# Altium schematic sheet Power.SchDoc (part 1 of 3)
size A3; SheetNumber: 2; SheetTotal: 5
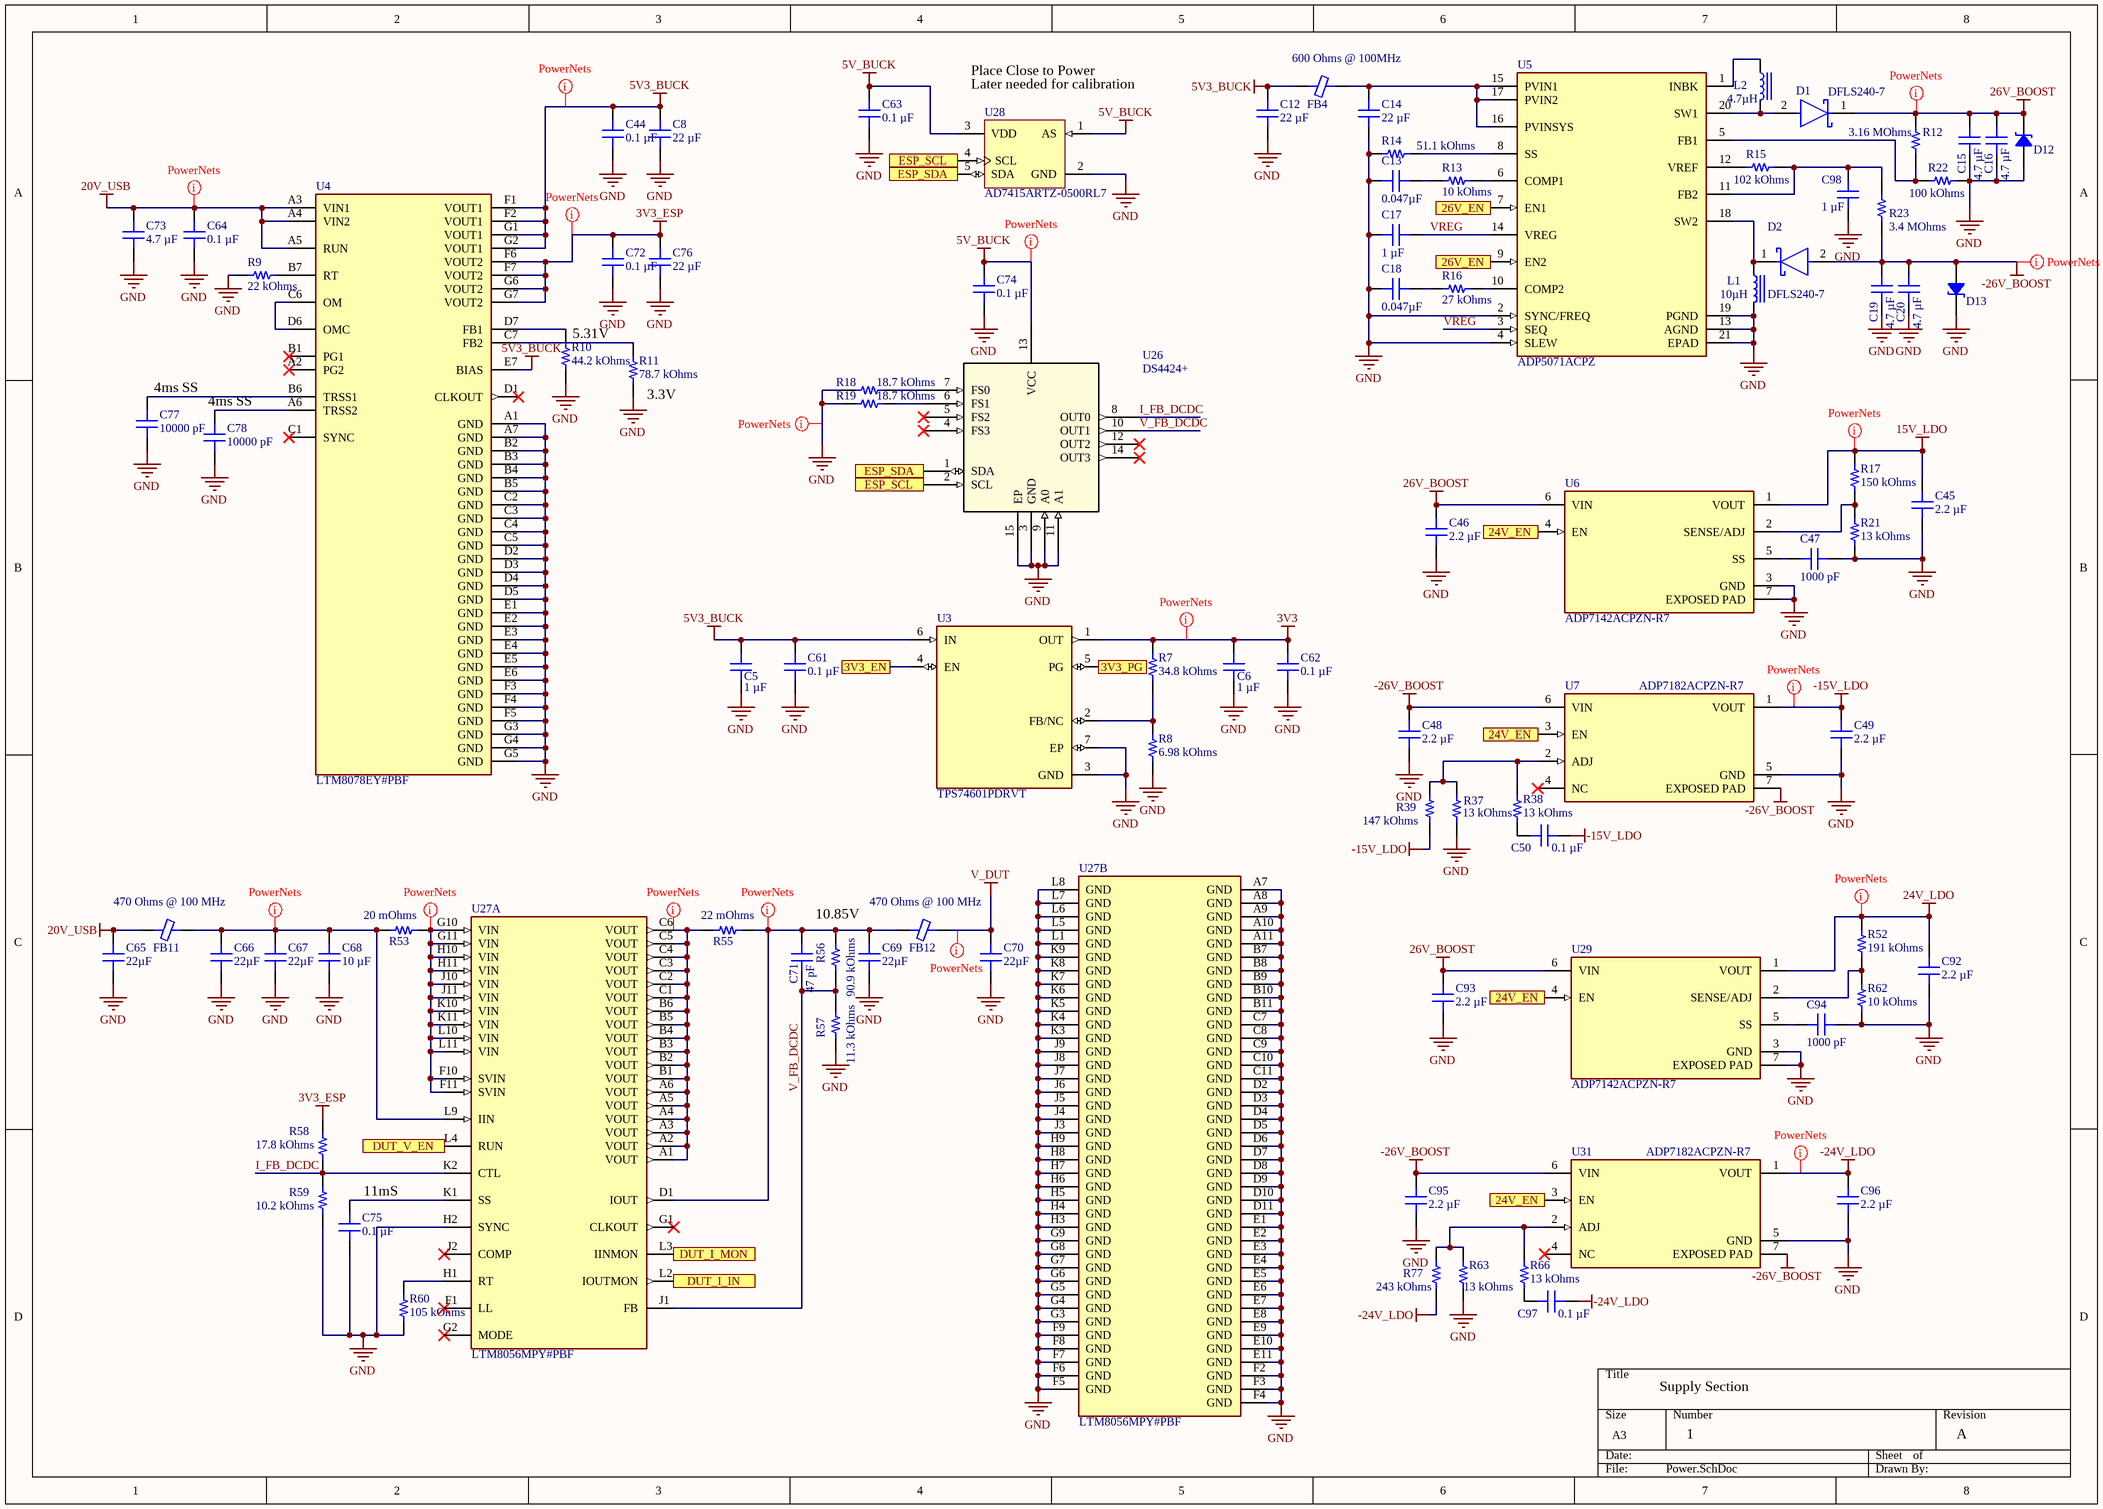
[diagram p0: Power.SchDoc]

## Parts
C5  1 µF  [CAP 0603_1608]
C6  1 µF  [CAP 0603_1608]
C8  22 µF  [CAP 0603_1608]
C12  22 µF  [CAP 0603_1608]
C13  0.047µF  [CAP 0603_1608]
C14  22 µF  [CAP 0603_1608]
C15  4.7 µF  [CAP 0805_2012]
C16  4.7 µF  [CAP 0805_2012]
C17  1 µF  [CAP 0603_1608]
C18  0.047µF  [CAP 0603_1608]
C19  4.7 µF  [CAP 0805_2012]
C20  4.7 µF  [CAP 0805_2012]
C44  0.1 µF  [CAP 0603_1608]
C45  2.2 µF  [CAP 0805_2012]
C46  2.2 µF  [CAP 0805_2012]
C47  1000 pF  [CAP 0603_1608]
C48  2.2 µF  [CAP 0805_2012]
C49  2.2 µF  [CAP 0805_2012]
C50  0.1 µF  [CAP 0603_1608]
C61  0.1 µF  [CAP 0603_1608]
C62  0.1 µF  [CAP 0603_1608]
C63  0.1 µF  [CAP 0603_1608]
C64  0.1 µF  [CAP 0603_1608]
C65  22µF  [CAP 2220_5650 3.0MM]
C66  22µF  [CAP 2220_5650 3.0MM]
C67  22µF  [CAP 2220_5650 3.0MM]
C68  10 µF  [CAP 1210_3225 - 1MM]
C69  22µF  [CAP 2220_5650 3.0MM]
C70  22µF  [CAP 2220_5650 3.0MM]
C71  47 pF  [CAP 0603_1608]
C72  0.1 µF  [CAP 0603_1608]
C73  4.7 µF  [CAP 0805_2012]
C74  0.1 µF  [CAP 0603_1608]
C75  0.1 µF  [CAP 0603_1608]
C76  22 µF  [CAP 0603_1608]
C77  10000 pF  [CAP 0603_1608]
C78  10000 pF  [CAP 0603_1608]
C92  2.2 µF  [CAP 0805_2012]
C93  2.2 µF  [CAP 0805_2012]
C94  1000 pF  [CAP 0603_1608]
C95  2.2 µF  [CAP 0805_2012]
C96  2.2 µF  [CAP 0805_2012]
C97  0.1 µF  [CAP 0603_1608]
C98  1 µF  [CAP 0603_1608]
D1  DFLS240-7  [FP-PowerDI123-MFG]
D2  DFLS240-7  [FP-PowerDI123-MFG]
D12  BZT52C27-7-F  [SOD-123]  (value not drawn)
D13  BZT52C27-7-F  [SOD-123]  (value not drawn)
FB4  600 Ohms @ 100MHz  [FER 0805_2012]
FB11  470 Ohms @ 100 MHz  [FER 1206_3216]
FB12  470 Ohms @ 100 MHz  [FER 1206_3216]
L1  10µH  [IND 1008_2520]
L2  4.7µH  [IND 1008_2520]
R7  34.8 kOhms  [RES 0603_1608]
R8  6.98 kOhms  [RES 0603_1608]
R9  22 kOhms  [RES 0603_1608]
R10  44.2 kOhms  [RES 0603_1608]
R11  78.7 kOhms  [RES 0603_1608]
R12  3.16 MOhms  [RES 0603_1608]
R13  10 kOhms  [RES 0603_1608]
R14  51.1 kOhms  [RES 0603_1608]
R15  102 kOhms  [RES 0603_1608]
R16  27 kOhms  [RES 0603_1608]
R17  150 kOhms  [RES 0603_1608]
R18  18.7 kOhms  [RES 0603_1608]
R19  18.7 kOhms  [RES 0603_1608]
R21  13 kOhms  [RES 0603_1608]
R22  100 kOhms  [RES 0603_1608]
R23  3.4 MOhms  [RES 0603_1608]
R37  13 kOhms  [RES 0603_1608]
R38  13 kOhms  [RES 0603_1608]
R39  147 kOhms  [RES 0603_1608]
R52  191 kOhms  [RES 0603_1608]
R53  20 mOhms  [STACKPOLE CSR1206]
R55  22 mOhms  [STACKPOLE CSR1206]
R56  90.9 kOhms  [RES 0603_1608]
R57  11.3 kOhms  [RES 0603_1608]
R58  17.8 kOhms  [RES 0603_1608]
R59  10.2 kOhms  [RES 0603_1608]
R60  105 kOhms  [RES 0603_1608]
R62  10 kOhms  [RES 0603_1608]
R63  13 kOhms  [RES 0603_1608]
R66  13 kOhms  [RES 0603_1608]
R77  243 kOhms  [RES 0603_1608]
U3  TPS74601PDRVT  [SON65P200X200X80-7N]
U4  LTM8078EY#PBF  [FP-BGA-49-05-08-1518-IPC_C]
U5  ADP5071ACPZ  [FP-CP-20-8-IPC_A]
U6  ADP7142ACPZN-R7  [FP-CP-6-3-IPC_B]
U7  ADP7182ACPZN-R7  [FP-CP-6-3-IPC_B]
U26  DS4424+  [21-0137_T1433+2_MXM]
U27  LTM8056MPY#PBF  [FP-BGA-121-05-08-1891-IPC_C]  (parts A,B of 2)
U28  AD7415ARTZ-0500RL7  [ADI-RJ-5_M]
U29  ADP7142ACPZN-R7  [FP-CP-6-3-IPC_B]
U31  ADP7182ACPZN-R7  [FP-CP-6-3-IPC_B]

## Ports
3V3_EN, 3V3_PG, 24V_EN, 26V_EN, DUT_I_IN, DUT_I_MON, DUT_V_EN, ESP_SCL, ESP_SDA

## Nets
3V3: C6.2 C62.2 R7.2 U3.1(OUT)
3V3_ESP: C72.2 C76.2 R58.2 U4.F6(VOUT2) U4.F7(VOUT2) U4.G6(VOUT2) U4.G7(VOUT2)
5V3_BUCK: C5.2 C8.2 C12.2 C44.2 C61.2 FB4.1 U3.6(IN) U4.E7(BIAS) U4.F1(VOUT1) U4.F2(VOUT1) U4.G1(VOUT1) U4.G2(VOUT1)
5V_BUCK: C63.2 C74.2 U26.13(VCC) U28.1(AS) U28.3(VDD)
15V_LDO: C45.2 R17.2 U6.1(VOUT)
20V_USB: C64.2 C65.2 C73.2 FB11.1 U4.A3(VIN1) U4.A4(VIN2) U4.A5(RUN)
24V_LDO: C92.2 R52.1 U29.1(VOUT)
26V_BOOST: C15.2 C16.2 C46.2 C93.2 D1.1(C) D12.2 R12.1 U6.6(VIN) U29.6(VIN)
-15V_LDO: C49.2 C50.1 R39.1 U7.1(VOUT)
-24V_LDO: C96.2 C97.1 R77.1 U31.1(VOUT)
-26V_BOOST: C19.2 C20.2 C48.2 C95.2 D2.2(A) D13.1 R23.1 U7.6(VIN) U7.7(EXPOSED_PAD) U31.6(VIN) U31.7(EXPOSED_PAD)
GND: C5.1 C6.1 C8.1 C12.1 C13.1 C14.1 C15.1 C16.1 C17.2 C18.1 C19.1 C20.1 C44.1 C45.1 C46.1 C47.2 C48.1 C49.1 C61.1 C62.1 C63.1 C64.1 C65.1 C66.1 C67.1 C68.1 C69.1 C70.1 C72.1 C73.1 C74.1 C75.1 C76.1 C77.1 C78.1 C92.1 C93.1 C94.2 C95.1 C96.1 C98.1 D12.1 D13.2 L1.2 R8.1 R9.1 R10.1 R11.1 R14.1 R18.1 R19.1 R21.1 R22.1 R37.1 R57.1 R59.1 R60.1 R62.1 R63.1 U3.3(GND) U3.7(EP) U4.A1(GND) U4.A7(GND) U4.B2(GND) U4.B3(GND) U4.B4(GND) U4.B5(GND) U4.C2(GND) U4.C3(GND) U4.C4(GND) U4.C5(GND) U4.D2(GND) U4.D3(GND) U4.D4(GND) U4.D5(GND) U4.E1(GND) U4.E2(GND) U4.E3(GND) U4.E4(GND) U4.E5(GND) U4.E6(GND) U4.F3(GND) U4.F4(GND) U4.F5(GND) U4.G3(GND) U4.G4(GND) U4.G5(GND) U5.2(SYNC/FREQ) U5.4(SLEW) U5.13(AGND) U5.19(PGND) U5.21(EPAD) U6.3(GND) U6.7(EXPOSED_PAD) U7.5(GND) U26.3(GND) U26.9(A0) U26.11(A1) U26.15(EP) U27.A7(GND) U27.A8(GND) U27.A9(GND) U27.A10(GND) U27.A11(GND) U27.B7(GND) U27.B8(GND) U27.B9(GND) U27.B10(GND) U27.B11(GND) U27.C7(GND) U27.C8(GND) U27.C9(GND) U27.C10(GND) U27.C11(GND) U27.D2(GND) U27.D3(GND) U27.D4(GND) U27.D5(GND) U27.D6(GND) U27.D7(GND) U27.D8(GND) U27.D9(GND) U27.D10(GND) U27.D11(GND) U27.E1(GND) U27.E2(GND) U27.E3(GND) U27.E4(GND) U27.E5(GND) U27.E6(GND) U27.E7(GND) U27.E8(GND) U27.E9(GND) U27.E10(GND) U27.E11(GND) U27.F2(GND) U27.F3(GND) U27.F4(GND) U27.F5(GND) U27.F6(GND) U27.F7(GND) U27.F8(GND) U27.F9(GND) U27.G3(GND) U27.G4(GND) U27.G5(GND) U27.G6(GND) U27.G7(GND) U27.G8(GND) U27.G9(GND) U27.H2(SYNC) U27.H3(GND) U27.H4(GND) U27.H5(GND) U27.H6(GND) U27.H7(GND) U27.H8(GND) U27.H9(GND) U27.J3(GND) U27.J4(GND) U27.J5(GND) U27.J6(GND) U27.J7(GND) U27.J8(GND) U27.J9(GND) U27.K3(GND) U27.K4(GND) U27.K5(GND) U27.K6(GND) U27.K7(GND) U27.K8(GND) U27.K9(GND) U27.L1(GND) U27.L5(GND) U27.L6(GND) U27.L7(GND) U27.L8(GND) U28.2(GND) U29.3(GND) U29.7(EXPOSED_PAD) U31.5(GND)
V_DUT: C70.2 FB12.2
3V3_EN: U3.4(EN) ; port 3V3_EN
3V3_PG: U3.5(PG) ; port 3V3_PG
24V_EN: U6.4(EN) U7.3(EN) U29.4(EN) U31.3(EN) ; port 24V_EN
26V_EN: U5.7(EN1) U5.9(EN2) ; port 26V_EN
DUT_I_IN: U27.L2(IOUTMON) ; port DUT_I_IN
DUT_I_MON: U27.L3(IINMON) ; port DUT_I_MON
DUT_V_EN: U27.L4(RUN) ; port DUT_V_EN
ESP_SCL: U26.2(SCL) U28.4(SCL) ; port ESP_SCL
ESP_SDA: U26.1(SDA) U28.5(SDA) ; port ESP_SDA
I_FB_DCDC: R58.1 R59.2 U26.8(OUT0) U27.K2(CTL)
V_FB_DCDC: C71.1 R56.1 R57.2 U26.10(OUT1) U27.J1(FB)
VREG: C17.1 U5.3(SEQ) U5.14(VREG)
NetC13_2: C13.2 R13.1
NetC14_2: C14.2 FB4.2 U5.15(PVIN1) U5.16(PVINSYS) U5.17(PVIN2)
NetC18_2: C18.2 R16.1
NetC47_1: C47.1 U6.5(SS)
NetC50_2: C50.2 R38.1
NetC66_2: C66.2 C67.2 C68.2 FB11.2 R53.1 U27.L9(IIN)
NetC69_2: C69.2 C71.2 FB12.1 R55.2 R56.2 U27.D1(IOUT)
NetC75_2: C75.2 U27.K1(SS)
NetC77_2: C77.2 U4.B6(TRSS1)
NetC78_2: C78.2 U4.A6(TRSS2)
NetC94_1: C94.1 U29.5(SS)
NetC97_2: C97.2 R66.1
NetC98_2: C98.2 R15.2 R23.2 U5.11(FB2)
NetD1_2: D1.2(A) L2.2 U5.20(SW1)
NetD2_1: D2.1(C) L1.1 U5.18(SW2)
NetL2_1: L2.1 U5.1(INBK)
NetR7_1: R7.1 R8.2 U3.2(FB/NC)
NetR9_2: R9.2 U4.B7(RT)
NetR10_2: R10.2 U4.D7(FB1)
NetR11_2: R11.2 U4.C7(FB2)
NetR12_2: R12.2 R22.2 U5.5(FB1)
NetR13_2: R13.2 U5.6(COMP1)
NetR14_2: R14.2 U5.8(SS)
NetR15_1: R15.1 U5.12(VREF)
NetR16_2: R16.2 U5.10(COMP2)
NetR17_1: R17.1 R21.2 U6.2(SENSE/ADJ)
NetR18_2: R18.2 U26.7(FS0)
NetR19_2: R19.2 U26.6(FS1)
NetR37_2: R37.2 R38.2 R39.2 U7.2(ADJ)
NetR52_2: R52.2 R62.2 U29.2(SENSE/ADJ)
NetR53_2: R53.2 U27.F10(SVIN) U27.F11(SVIN) U27.G10(VIN) U27.G11(VIN) U27.H10(VIN) U27.H11(VIN) U27.J10(VIN) U27.J11(VIN) U27.K10(VIN) U27.K11(VIN) U27.L10(VIN) U27.L11(VIN)
NetR55_1: R55.1 U27.A1(VOUT) U27.A2(VOUT) U27.A3(VOUT) U27.A4(VOUT) U27.A5(VOUT) U27.A6(VOUT) U27.B1(VOUT) U27.B2(VOUT) U27.B3(VOUT) U27.B4(VOUT) U27.B5(VOUT) U27.B6(VOUT) U27.C1(VOUT) U27.C2(VOUT) U27.C3(VOUT) U27.C4(VOUT) U27.C5(VOUT) U27.C6(VOUT)
NetR60_2: R60.2 U27.H1(RT)
NetR63_2: R63.2 R66.2 R77.2 U31.2(ADJ)
NetU4_C6: U4.C6(OM) U4.D6(OMC)

Not connected (* = marked no-connect by the designer): U4 A2(PG2)* B1(PG1)* C1(SYNC)* D1(CLKOUT)*; U7 4(NC)*; U26 4(FS3)* 5(FS2)* 12(OUT2)* 14(OUT3)*; U27 F1(LL)* G1(CLKOUT)* G2(MODE)* J2(COMP)*; U31 4(NC)*

## Layout directives
net class PowerNets: 3V3, 3V3_ESP, 5V3_BUCK, 5V_BUCK, 15V_LDO, 20V_USB, 24V_LDO, 26V_BOOST, -15V_LDO, -24V_LDO, -26V_BOOST, GND, NetC66_2, NetC69_2, NetR53_2, NetR55_1, V_DUT

## Notes on the sheet
- Place Close to Power
- (near U28) Later needed for calibration
- (near R10) 5.31V
- (near C77) 4ms SS
- (near C78) 4ms SS
- (near R11) 3.3V
- 10.85V
- (near C75) 11mS
- Supply Section
- 1
- A